# EAGLE design driver 21 aldo 1 (EAGLE 9.6.2)
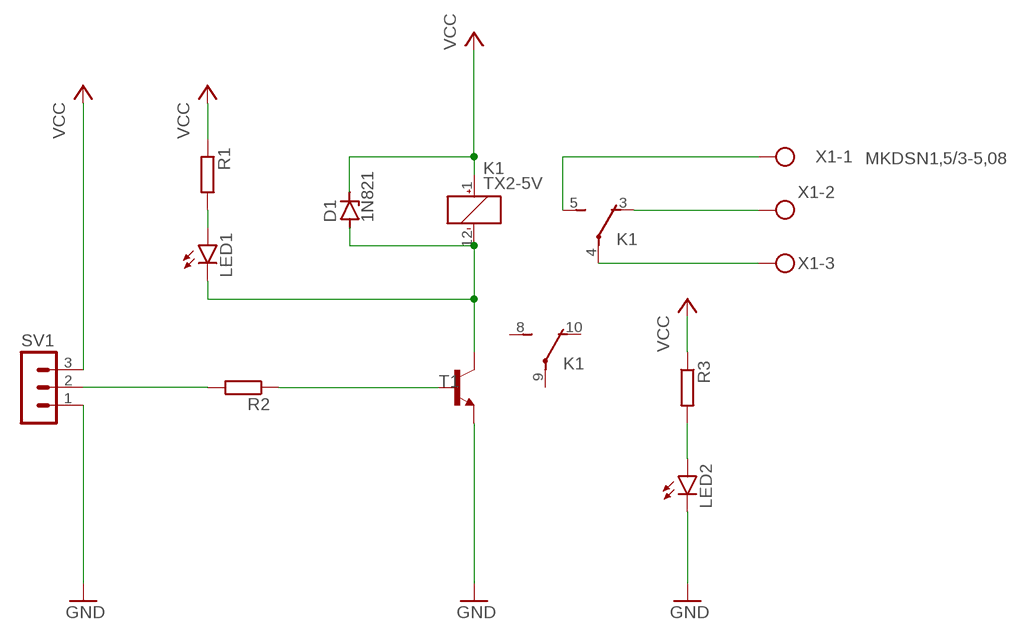
[diagram p0: schematic, sheet 1]

## Parts
D1  1N821  [DO35Z10]
K1  TX2-5V  [TX2]
LED1  LED3MM  [LED3MM]
LED2  LED3MM  [LED3MM]
R1  R-EU_0204/2V  [0204V]
R2  R-EU_0204/2V  [0204V]
R3  R-EU_0204/2V  [0204V]
SV1  MA03-1  [MA03-1]
T1  -NPN-TO92  [TO92]
X1  MKDSN1,5/3-5,08  [MKDSN1,5/3-5,08]

## Nets
GND: LED2.K(C) SV1.1 T1.1(E)
N$1: R2.2 SV1.2
N$2: D1.A K1.12(_:-) LED1.K(C) T1.3(C)
N$3: LED1.A R1.2
N$4: R2.1 T1.2(B)
N$5: K1.3(1:O) X1.2
N$6: K1.5(1:S) X1.1
N$7: K1.4(1:P) X1.3
N$8: LED2.A R3.2
VCC: D1.C K1.1(_:+) R1.1 R3.1 SV1.3
Unconnected: K1.8(2:S) K1.9(2:P) K1.10(2:O)

## Library data of the parts
D1 = diode:1N821: Reference DIODE temperature compensated, 6,2 V
K1 = relay:TX2?-*: 2 AMP. HIGH CAPACITY RELAY NAiS WITH HIGH SURGE VOLTAGE & HIGH BREAKDOWN VOLTAGE Source: http://www.mew-europe.com/.. en_ds_61022_0001.pdf; MF: AROMAT/ MATSUSHITA; MPN: TX2-5V; OC_FARNELL: 1200950; OC_NEWARK: 67K1296
LED1 LED2 = led:LED: LED OSRAM: - CHIPLED LG R971, LG N971, LY N971, LG Q971, LY Q971, LO R971, LY R971 LH N974, LH R974 LS Q976, LO Q976, LY Q976 LO Q996 - Hyper CHIPLED LW Q18S LB Q993, LB Q99A, LB R99A - SideLED LS A670, LO A670, LY A670, LG A670, LP A670 LB A673, LV A673, LT A673, LW A673 LH A674 LY A675 LS A676, LA A676, LO A676, LY A676, LW A676 LS A679, LY A679, LG A679 - Hyper Micro SIDELED® LS Y876, LA Y876, LO Y876, LY Y876 LT Y87S - SmartLED LW L88C, LW L88S LB L89C, LB L89S, LG L890 LS L89K, LO L89K, LY L89K LS L896, LA L896, LO L896, LY L896 - TOPLED LS T670, LO T670, LY T670, LG T670, LP T670 LSG T670, LSP T670, LSY T670, LOP T670, LYG T670 LG T671, LOG T671, LSG T671 LB T673, LV T673, LT T673, LW T673 LH T674 LS T676, LA T676, LO T676, LY T676, LB T676, LH T676, LSB T676, LW T676 LB T67C, LV T67C, LT T67C, LS T67K, LO T67K, LY T67K, LW E67C LS E67B, LA E67B, LO E67B, LY E67B, LB E67C, LV E67C, LT E67C LW T67C LS T679, LY T679, LG T679 LS T770, LO T770, LY T770, LG T770, LP T770 LB T773, LV T773, LT T773, LW T773 LH T774 LS E675, LA E675, LY E675, LS T675 LS T776, LA T776, LO T776, LY T776, LB T776 LHGB T686 LT T68C, LB T68C - Hyper Mini TOPLED® LB M676 - Mini TOPLED Santana® LG M470 LS M47K, LO M47K, LY M47K Source: http://www.osram.convergy.de LUXEON: - LUMILED® LXK2-PW12-R00, LXK2-PW12-S00, LXK2-PW14-U00, LXK2-PW14-V00 LXK2-PM12-R00, LXK2-PM12-S00, LXK2-PM14-U00 LXK2-PE12-Q00, LXK2-PE12-R00, LXK2-PE12-S00, LXK2-PE14-T00, LXK2-PE14-U00 LXK2-PB12-K00, LXK2-PB12-L00, LXK2-PB12-M00, LXK2-PB14-N00, LXK2-PB14-P00, LXK2-PB14-Q00 LXK2-PR12-L00, LXK2-PR12-M00, LXK2-PR14-Q00, LXK2-PR14-R00 LXK2-PD12-Q00, LXK2-PD12-R00, LXK2-PD12-S00 LXK2-PH12-R00, LXK2-PH12-S00 LXK2-PL12-P00, LXK2-PL12-Q00, LXK2-PL12-R00 Source: www.luxeon.com KINGBRIGHT: KA-3528ASYC Source: www.kingbright.com
R1-R3 = rcl:R-EU_: RESISTOR, European symbol; SPICEPREFIX: R
SV1 = con-lstb:MA03-1: PIN HEADER; OC_FARNELL: unknown; OC_NEWARK: unknown
T1 = transistor:*-NPN-: NPN Transistror BF959 corrected 2008.03.06
X1 = con-phoenix-508:MKDSN1,5/3-5,08: MKDSN 1,5/ 3-5,08 Printklemme Nennstrom: 13,5 A Nennspannung: 250 V Rastermaß: 5,08 mm Polzahl: 3 Anschlussart: Schraubanschluss Montage: Löten Anschlussrichtung Leiter/Platine: 0 ° Artikelnummer: 1729131 Source: http://eshop.phoenixcontact.com .. 1729131.pdf

## Board
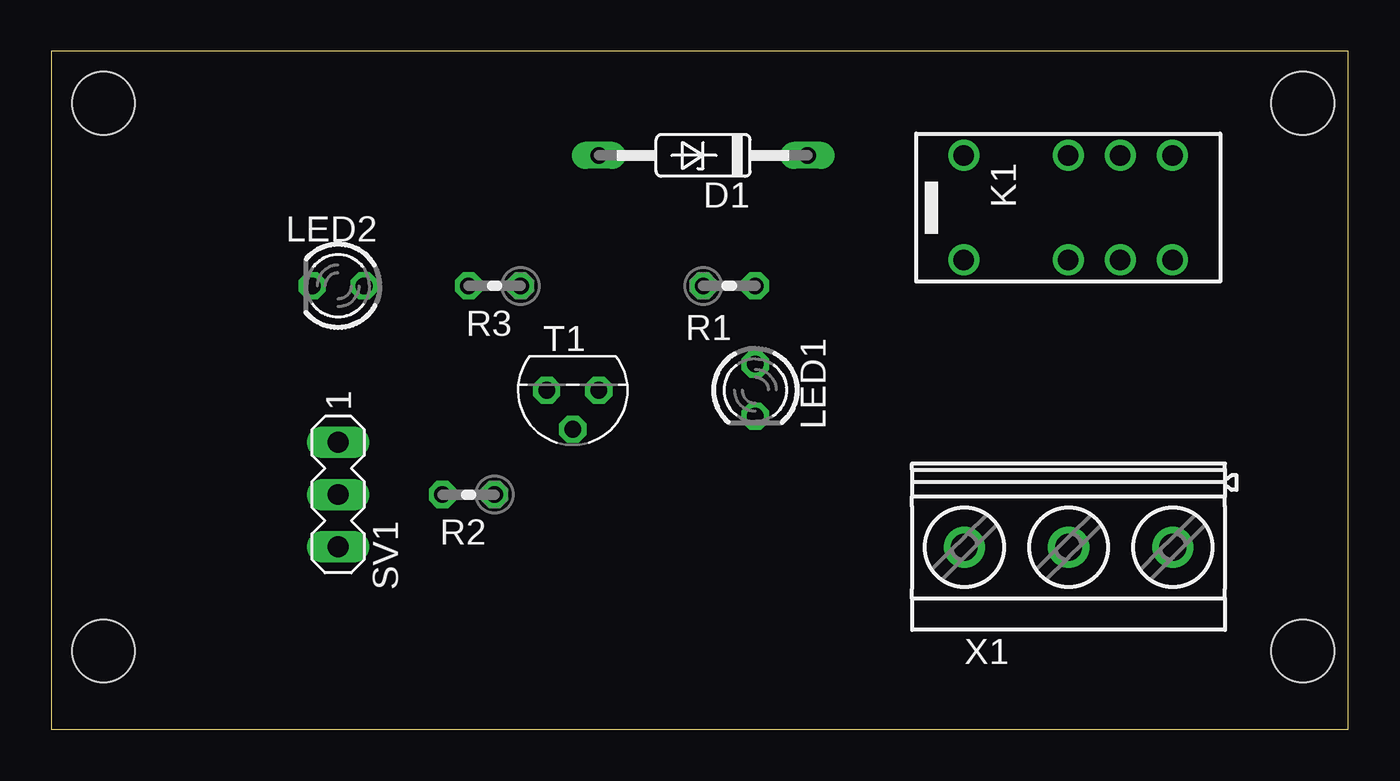
[diagram p1: board, top side]
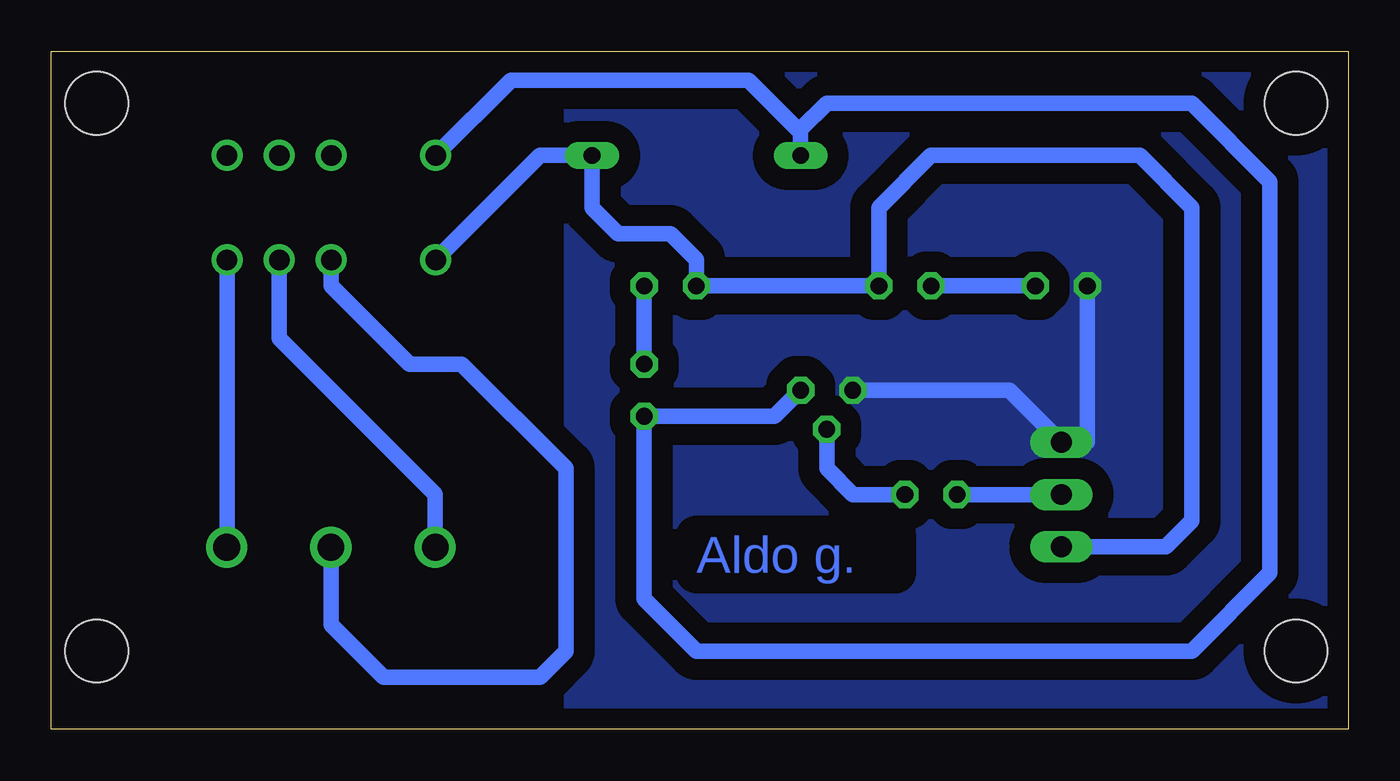
[diagram p2: board, bottom side, seen from below]

Size 63.17 x 33.01 mm. Coordinates in mm from the lower left corner, seen from the top.
Outline: 0,0 63.17,0 63.17,33.01 0,33.01 0,0
Copper layers (1*16): Top 0.035mm / dielectric 1.5mm / Bottom 0.035mm
Design rules "default": minimum track width 6mil, minimum drill 0.35mm, track to track 6mil, track to pad 6mil, pad to pad 6mil, via to via 6mil, smd to smd 6mil, copper to edge 40mil, drill to drill 6mil, minimum pad ring 10mil, minimum via ring 8mil, stop-mask expansion 4mil, vias tented up to drill 0mil, thermal gap 10mil
Holes 3.05 mm at 2.54,30.48 2.54,3.81 60.96,30.48 60.96,3.81

### Footprints (pad centres in the part's own frame; a part is rotated, then mirrored left to right if it is on the bottom)
DO35Z10 = drill 0.813 long: A 5.08,0; C -5.08,0
TX2 = drill 1: 1 -5.08,-2.54; 3 0,-2.54; 4 2.54,-2.54; 5 5.08,-2.54; 8 5.08,2.54; 9 2.54,2.54; 10 0,2.54; 12 -5.08,2.54
LED3MM = drill 0.813 octagon: A -1.27,0; K 1.27,0
0204V = drill 0.813 octagon: 1 -1.27,0; 2 1.27,0
MA03-1 = drill 1.016 long: 1 -2.54,0; 2 0,0; 3 2.54,0
TO92 = drill 0.813 octagon: 1 1.27,0; 2 0,1.905; 3 -1.27,0
MKDSN1,5/3-5,08 = drill 1.3 pad 2: 1 -7.641,0.025; 2 -2.561,0.025; 3 2.519,0.025

### Placement (x,y rotation side)
D1  31.75,27.94 180 top
K1  49.53,25.4 0 top
LED1  34.29,16.51 270 top
LED2  13.97,21.59 180 top
R1  33.02,21.59 0 top
R2  20.32,11.43 180 top
R3  21.59,21.59 180 top
SV1  13.97,11.43 270 top
T1  25.4,16.51 180 top
X1  46.99,8.89 180 top

### Tracks (layer width: path | path; a pad name or v marks a point on that pad's centre or on a via)
GND
  Bottom 0.762: T1.1 16.51,16.51 SV1.1 12.7,13.97 LED2.K
  pour Bottom (isolate 1.016, no thermals): 0,33.02 38.1,33.02 38.1,0 0,0
N$1
  Bottom 0.762: SV1.2 R2.2
N$2
  Bottom 0.762: T1.3 27.94,15.24 LED1.K 34.29,6.35 31.75,3.81 7.62,3.81 3.81,7.62 3.81,26.67 7.62,30.48 25.4,30.48 26.67,29.21 D1.A 26.67,29.07 29.21,31.61 40.78,31.61 K1.12
N$3
  Bottom 0.762: R1.2 LED1.A
N$4
  Bottom 0.762: R2.1 24.13,11.43 25.4,12.7 T1.2
N$5
  Bottom 0.762: K1.3 49.53,21.59 45.72,17.78 43.18,17.78 38.1,12.7 38.1,3.81 39.37,2.54 46.99,2.54 49.55,5.1 X1.2
N$6
  Bottom 0.762: K1.5 54.61,8.89 X1.1
N$7
  Bottom 0.762: X1.3 44.47,11.45 52.07,19.05 K1.4
N$8
  Bottom 0.762: R3.2 LED2.A
VCC
  Bottom 0.762: SV1.3 8.89,8.89 7.62,10.16 7.62,25.4 10.16,27.94 20.32,27.94 22.86,25.4 R3.1 R1.1 31.75,22.86 33.02,24.13 35.56,24.13 36.83,25.4 D1.C 39.37,27.94 K1.1

### Text on the board
Bottom: Aldo g.